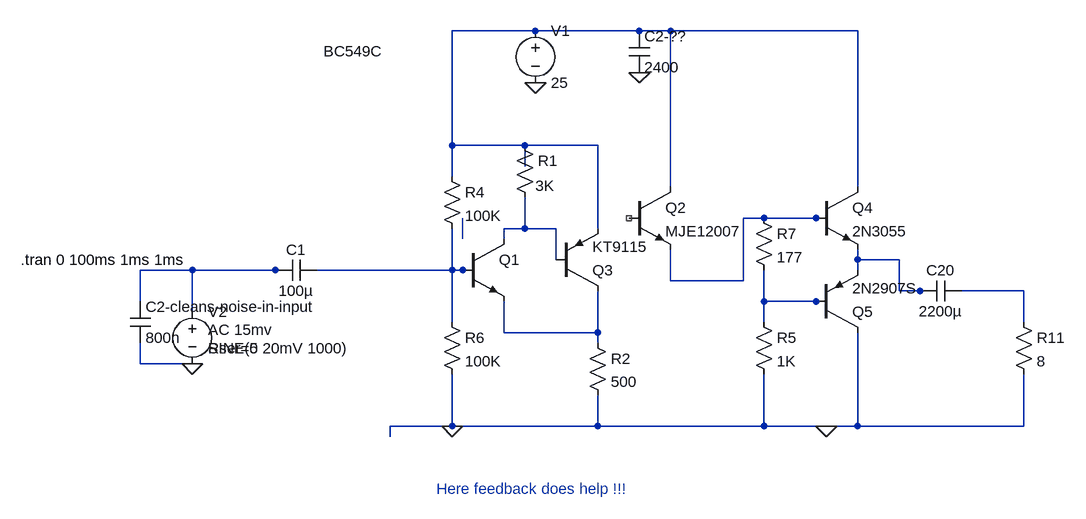
[diagram p0: schematic Complementary feedback pair.asc]
Complementary feedback pair.asc, the LTspice schematic file:
Version 4
SHEET 1 1788 680
WIRE 272 -256 144 -256
WIRE 432 -256 272 -256
WIRE 480 -256 432 -256
WIRE 768 -256 480 -256
WIRE 144 -80 144 -256
WIRE 256 -80 144 -80
WIRE 368 -80 256 -80
WIRE 256 -48 256 -80
WIRE 144 -32 144 -80
WIRE 480 -16 480 -256
WIRE 768 -16 768 -256
WIRE 624 32 592 32
WIRE 704 32 624 32
WIRE 720 32 704 32
WIRE 256 48 256 0
WIRE 256 48 224 48
WIRE 304 48 256 48
WIRE 368 48 368 -80
WIRE 160 64 160 32
WIRE 224 64 224 48
WIRE 304 96 304 48
WIRE 768 96 768 80
WIRE 832 96 768 96
WIRE -256 112 -336 112
WIRE -128 112 -256 112
WIRE -112 112 -128 112
WIRE 144 112 144 48
WIRE 144 112 -64 112
WIRE 160 112 144 112
WIRE 176 112 160 112
WIRE 768 112 768 96
WIRE 480 128 480 80
WIRE 592 128 592 32
WIRE 592 128 480 128
WIRE 832 144 832 96
WIRE 864 144 832 144
WIRE 880 144 864 144
WIRE 1024 144 928 144
WIRE -336 160 -336 112
WIRE 624 160 624 112
WIRE 704 160 624 160
WIRE 720 160 704 160
WIRE -256 176 -256 112
WIRE 144 192 144 112
WIRE 624 192 624 160
WIRE 1024 192 1024 144
WIRE 224 208 224 160
WIRE 368 208 368 144
WIRE 368 208 224 208
WIRE 368 224 368 208
WIRE -336 256 -336 224
WIRE -256 256 -336 256
WIRE 144 352 144 272
WIRE 144 352 48 352
WIRE 368 352 368 304
WIRE 368 352 144 352
WIRE 624 352 624 272
WIRE 624 352 368 352
WIRE 720 352 624 352
WIRE 768 352 768 208
WIRE 768 352 720 352
WIRE 1024 352 1024 272
WIRE 1024 352 768 352
WIRE 48 368 48 352
FLAG 272 -176 0
FLAG 144 352 0
FLAG -256 256 0
FLAG 720 352 0
FLAG 432 -192 0
SYMBOL npn 160 64 R0
WINDOW 3 -214 -289 Left 2
SYMATTR Value BC549C
SYMATTR InstName Q1
SYMBOL res 240 -96 R0
WINDOW 3 32 78 Left 2
SYMATTR InstName R1
SYMATTR Value 3K
SYMBOL voltage 272 -272 R0
WINDOW 123 0 0 Left 2
WINDOW 39 0 0 Left 2
SYMATTR InstName V1
SYMATTR Value 25
SYMBOL res 352 208 R0
SYMATTR InstName R2
SYMATTR Value 500
SYMBOL cap -64 96 R90
WINDOW 0 0 32 VBottom 2
WINDOW 3 32 32 VTop 2
SYMATTR InstName C1
SYMATTR Value 100µ
SYMBOL voltage -256 160 R0
WINDOW 123 24 44 Left 2
WINDOW 39 24 72 Left 2
WINDOW 3 24 72 Left 2
SYMATTR Value2 AC 15mv
SYMATTR SpiceLine Rser=5
SYMATTR Value SINE(0 20mV 1000)
SYMATTR InstName V2
SYMBOL npn2 704 -16 R0
SYMATTR InstName Q4
SYMATTR Value 2N3055
SYMBOL res 1008 176 R0
SYMATTR InstName R11
SYMATTR Value 8
SYMBOL pnp 704 208 M180
SYMATTR InstName Q5
SYMATTR Value 2N2907S
SYMBOL cap 928 128 R90
WINDOW 0 0 32 VBottom 2
WINDOW 3 32 32 VTop 2
SYMATTR InstName C20
SYMATTR Value 2200µ
SYMBOL res 608 176 R0
SYMATTR InstName R5
SYMATTR Value 1K
SYMBOL res 608 16 R0
SYMATTR InstName R7
SYMATTR Value 177
SYMBOL cap 416 -256 R0
SYMATTR InstName C2-??
SYMATTR Value 2400
SYMBOL npn 416 -16 R0
SYMATTR InstName Q2
SYMATTR Value MJE12007
SYMBOL cap -352 160 R0
SYMATTR InstName C2-cleans-noise-in-input
SYMATTR Value 800n
SYMBOL pnp 304 144 M180
SYMATTR InstName Q3
SYMATTR Value KT9115
SYMBOL res 128 -48 R0
SYMATTR InstName R4
SYMATTR Value 100K
SYMBOL res 128 176 R0
SYMATTR InstName R6
SYMATTR Value 100K
TEXT -520 96 Left 2 !.tran 0 100ms 1ms 1ms
TEXT 120 448 Left 2 ;Here feedback does help !!!

The netlist it stands for:
* Complementary feedback pair.asc
Q1 N003 N007 N010 0 BC549C
R1 N001 N003 3K
V1 N001 0 25
R2 N010 0 500
C1 N007 N006 100µ
V2 N006 0 SINE(0 20mV 1000) AC 15mv Rser=5
Q4 N001 N002 N005 0 2N3055
R11 N008 0 8
Q5 0 N009 N005 0 2N2907S
C20 N008 N005 2200µ
R5 N009 0 1K
R7 N002 N009 177
C2-?? N001 0 2400
Q2 N001 NC_01 N002 0 MJE12007
C2-cleans-noise-in-input N006 0 800n
Q3 N010 N003 N001 0 KT9115
R4 N001 N007 100K
R6 N007 0 100K
.model NPN NPN
.model PNP PNP
.lib standard.bjt
.tran 0 100ms 1ms 1ms
* Here feedback does help !!!
.backanno
.end